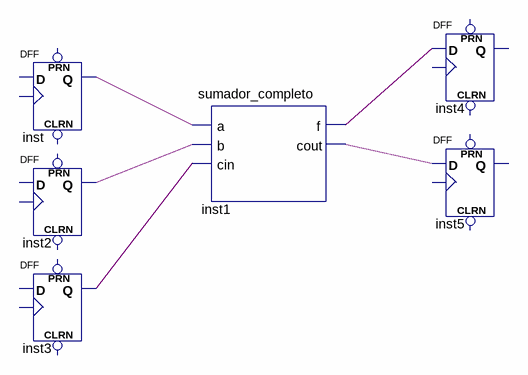
[diagram p0: schematic sheet]
// Quartus schematic schematic.bdf as structural Verilog: 6 symbols, 0 pins
module schematic (
);

  wire inst1_cout, inst1_f, inst2_q, inst3_q, inst_q;

  DFF inst (.Q(inst_q));  // open: CLRN, CLK, D, PRN
  DFF inst2 (.Q(inst2_q));  // open: CLRN, CLK, D, PRN
  DFF inst3 (.Q(inst3_q));  // open: CLRN, CLK, D, PRN
  sumador_completo inst1 (.a(inst_q), .b(inst2_q), .cin(inst3_q), .f(inst1_f), .cout(inst1_cout));
  DFF inst4 (.D(inst1_f));  // open: CLRN, CLK, PRN, Q
  DFF inst5 (.D(inst1_cout));  // open: CLRN, CLK, PRN, Q
endmodule
